# Altium schematic sheet VNH9013Y.SchDoc
size A4; SheetNumber: 1; SheetTotal: 2
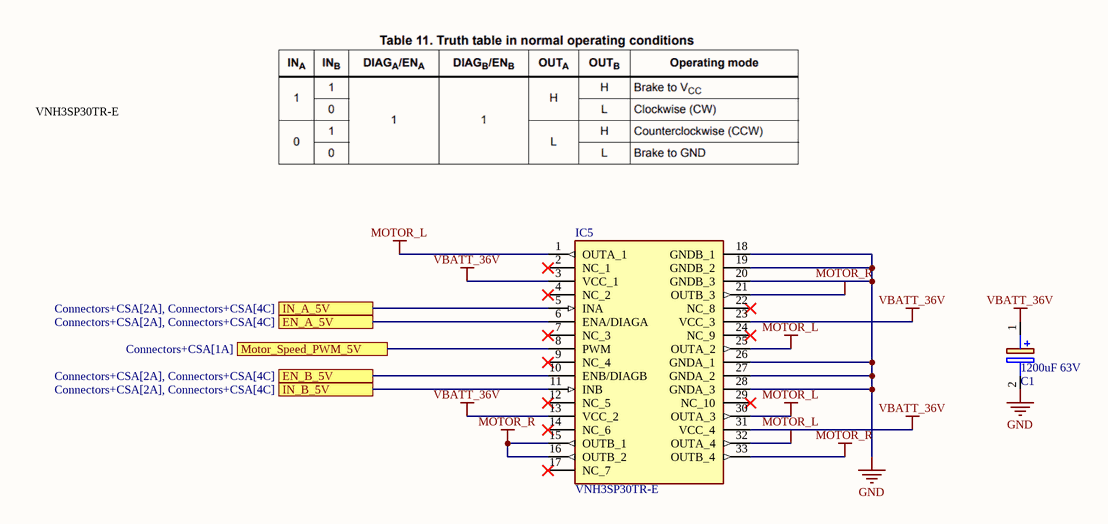
[diagram p0: VNH9013Y.SchDoc]

## Parts
C1  1200uF 63V  [CAPPRD750W80D1825H3750]
IC5  VNH3SP30TR-E  [MULTIPOWERSO-30]

## Ports
EN_A_5V (see Connectors+CSA[2A], Connectors+CSA[4C]), EN_B_5V (see Connectors+CSA[2A], Connectors+CSA[4C]), IN_A_5V (see Connectors+CSA[2A], Connectors+CSA[4C]), IN_B_5V (see Connectors+CSA[2A], Connectors+CSA[4C]), Motor_Speed_PWM_5V (see Connectors+CSA[1A])

## Nets
GND: C1.2(-) IC5.18(GNDB_1) IC5.19(GNDB_2) IC5.20(GNDB_3) IC5.26(GNDA_1) IC5.27(GNDA_2) IC5.28(GNDA_3)
MOTOR_L: IC5.1(OUTA_1) IC5.25(OUTA_2) IC5.30(OUTA_3) IC5.32(OUTA_4)
MOTOR_R: IC5.15(OUTB_1) IC5.16(OUTB_2) IC5.21(OUTB_3) IC5.33(OUTB_4)
VBATT_36V: C1.1(+) IC5.3(VCC_1) IC5.13(VCC_2) IC5.23(VCC_3) IC5.31(VCC_4)
EN_A_5V: IC5.6(ENA/DIAGA) ; port EN_A_5V
EN_B_5V: IC5.10(ENB/DIAGB) ; port EN_B_5V
IN_A_5V: IC5.5(INA) ; port IN_A_5V
IN_B_5V: IC5.11(INB) ; port IN_B_5V
Motor_Speed_PWM_5V: IC5.8(PWM) ; port Motor_Speed_PWM_5V

Not connected (* = marked no-connect by the designer): IC5 2(NC_1)* 4(NC_2)* 7(NC_3)* 9(NC_4)* 12(NC_5)* 14(NC_6)* 17(NC_7)* 22(NC_8)* 24(NC_9)* 29(NC_10)*

## Notes on the sheet
- VNH3SP30TR-E

## Library data of the parts
C1 = UHE1J122MHD6: Capacitor Polarised; Manufacturer_Name: Nichicon; Datasheet Link: https://products.nichicon.co.jp/en/pdf/XJA043/e-uhe.pdf; Height: 37.5mm; Manufacturer_Part_Number: UHE1J122MHD6; Mouser Part Number: 647-UHE1J122MHD6; Mouser Price/Stock: https://www.mouser.co.uk/ProductDetail/Nichicon/UHE1J122MHD6?qs=3w7tHOhcdefSsEo8Zd8Pmw%3D%3D; Arrow Part Number: UHE1J122MHD6; Arrow Price/Stock: https://www.arrow.com/en/products/uhe1j122mhd6/nichicon; Supplier 1: Digikey; Supplier Part Number 1: 493-1656-ND
IC5 = VNH3SP30TR-E: Integrated Circuit; Manufacturer_Name: STMicroelectronics; Datasheet Link: http://www.st.com/web/en/resource/technical/document/datasheet/CD00134336.pdf; Manufacturer_Part_Number: VNH3SP30TR-E; Mouser Part Number: 511-VNH3SP30TR-E; Mouser Price/Stock: https://www.mouser.co.uk/ProductDetail/STMicroelectronics/VNH3SP30TR-E?qs=po45yt2pPpsUU4ftWFEieA%3D%3D; Arrow Part Number: VNH3SP30TR-E; Arrow Price/Stock: https://www.arrow.com/en/products/vnh3sp30tr-e/stmicroelectronics?region=nac